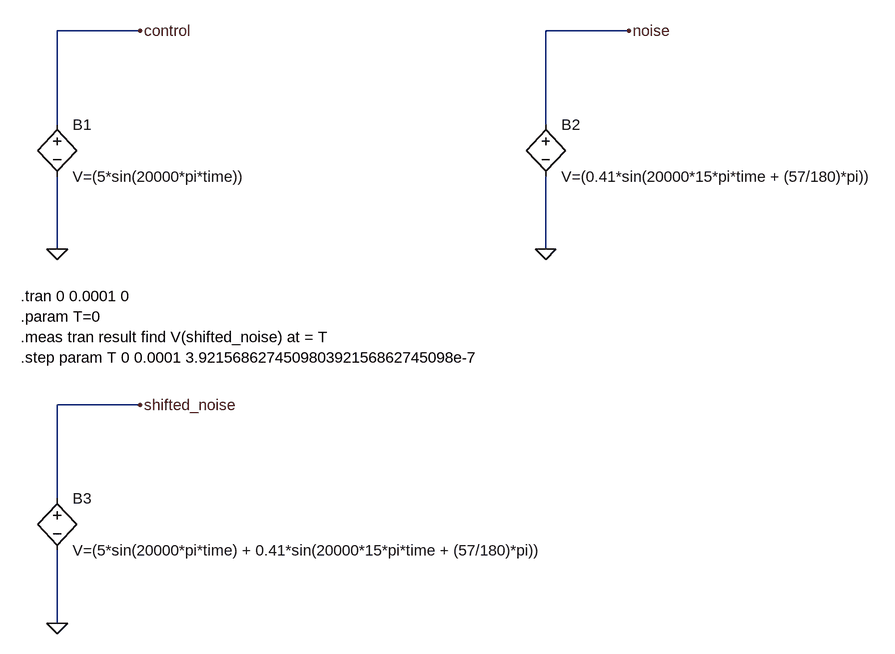
[diagram p0: schematic 4063_Project.asc]
4063_Project.asc, the LTspice schematic file:
Version 4.1
SHEET 1 1472 916
WIRE 240 -16 112 -16
WIRE 992 -16 864 -16
WIRE 112 128 112 -16
WIRE 864 128 864 -16
WIRE 112 320 112 208
WIRE 864 320 864 208
WIRE 240 560 112 560
WIRE 112 704 112 560
WIRE 112 896 112 784
FLAG 240 -16 control
FLAG 112 320 0
FLAG 992 -16 noise
FLAG 864 320 0
FLAG 240 560 shifted_noise
FLAG 112 896 0
SYMBOL bv 112 112 R0
SYMATTR InstName B1
SYMATTR Value V=(5*sin(20000*pi*time))
SYMBOL bv 864 112 R0
SYMATTR InstName B2
SYMATTR Value V=(0.41*sin(20000*15*pi*time + (57/180)*pi))
SYMBOL bv 112 688 R0
SYMATTR InstName B3
SYMATTR Value V=(5*sin(20000*pi*time) + 0.41*sin(20000*15*pi*time + (57/180)*pi))
TEXT 56 392 Left 2 !.tran 0 0.0001 0
TEXT 56 424 Left 2 !.param T=0\n.meas tran result find V(shifted_noise) at = T\n.step param T 0 0.0001 3.921568627450980392156862745098e-7

The netlist it stands for:
* 4063_Project.asc
B1 control 0 V=(5*sin(20000*pi*time))
B2 noise 0 V=(0.41*sin(20000*15*pi*time + (57/180)*pi))
B3 shifted_noise 0 V=(5*sin(20000*pi*time) + 0.41*sin(20000*15*pi*time + (57/180)*pi))
.tran 0 0.0001 0
.param T=0
.meas tran result find V(shifted_noise) at = T
.step param T 0 0.0001 3.921568627450980392156862745098e-7
.backanno
.end